# EAGLE schematic Arduino-Pro-Mini (EAGLE 8.0.1)
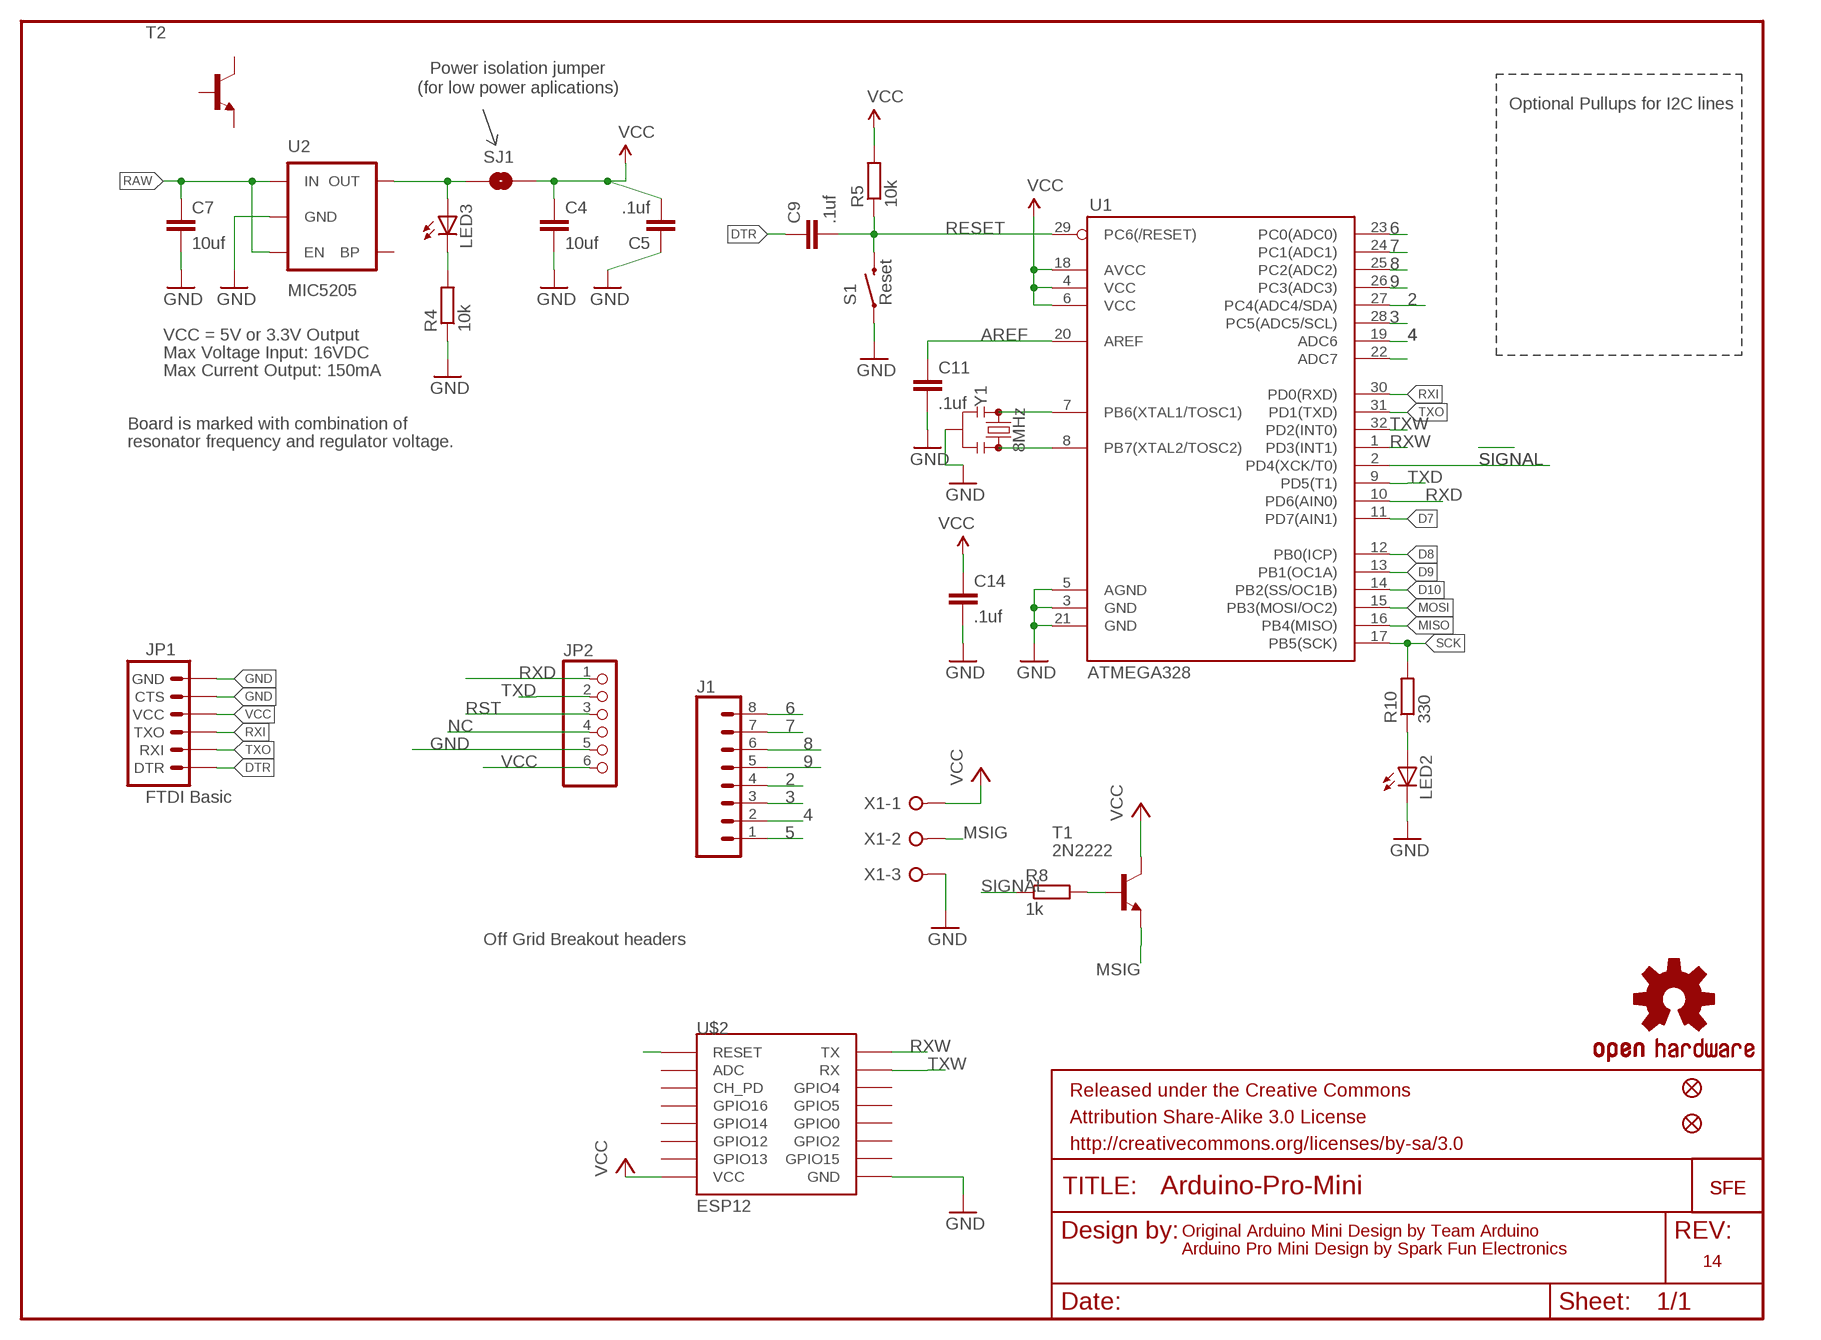
[diagram p0: schematic, sheet 1]

## Parts
C4  10uf  C-EUC1206  [C1206]
C5  .1uf  C-EUC1206  [C1206]
C7  10uf  C-EUC1206  [C1206]
C9  .1uf  C-EUC1206  [C1206]
C11  .1uf  C-EUC1206  [C1206]
C14  .1uf  C-EUC1206  [C1206]
FRAME1  FRAME-LETTER  [CREATIVE_COMMONS]
J1  CONN_08"  [1X08]
JP1  FTDI Basic  ARDUINO_SERIAL_PROGRAMPTH  [1X06]
JP2  PINHD-1X6  [1X06]
JP5  FIDUCIALUFIDUCIAL  [MICRO-FIDUCIAL]
JP8  FIDUCIALUFIDUCIAL  [MICRO-FIDUCIAL]
LED2  LEDCHIPLED_1206  [CHIPLED_1206]
LED3  LEDCHIPLED_1206  [CHIPLED_1206]
R4  10k  R-EU_M1206  [M1206]
R5  10k  R-EU_M1206  [M1206]
R8  1k  R-EU_M1206  [M1206]
R10  330  R-EU_M1206  [M1206]
S1  Reset  SWITCH-MOMENTARY-2SMD-ALT01  [TACTILE-SWITCH-SMD-ALT01]
SJ1  SOLDERJUMPERNC  [SJ_2S]
T1  2N2222  [TO92-EBC-OVAL]
T2  -NPN-SOT223  [SOT223]
U1  ATMEGA328  ATMEGA168  [TQFP32-08]
U2  MIC5205  V_REG_LDOSMD  [SOT23-5]
U$1  LOGO-SFESK  [SFE-LOGO-FLAME]
U$2  ESP12  [ESP12]
U$3  OSHW-LOGOS  [OSHW-LOGO-S]
U$11  LOGO-SFENEW  [SFE-NEW-WEBLOGO]
X1  W237-3E  [W237-3E]
Y1  8MHz  RESONATOR-8MHZSMD_3.2X1.3  [RESONATOR-SMD-3.2X1.3]

## Nets
2: J1.4 U1.27(PC4(ADC4/SDA))
3: J1.3 U1.28(PC5(ADC5/SCL))
4: J1.2 U1.19(ADC6)
5: J1.1 U1.22(ADC7)
6: J1.8 U1.23(PC0(ADC0))
7: J1.7 U1.24(PC1(ADC1))
8: J1.6 U1.25(PC2(ADC2))
9: J1.5 U1.26(PC3(ADC3))
AREF: C11.1 U1.20(AREF)
D7: U1.11(PD7(AIN1))
D8: U1.12(PB0(ICP))
D9: U1.13(PB1(OC1A))
D10: U1.14(PB2(SS/OC1B))
DTR: C9.1 JP1.1(DTR)
GND [vcc]: C4.2 C5.1 C7.2 C11.2 C14.2 JP1.5(CTS) JP1.6(GND) JP2.5 LED2.C R4.1 S1.1 S1.2 U1.3(GND) U1.5(AGND) U1.21(GND) U2.2(GND) U$2.GND X1.3 Y1.2
MISO: U1.16(PB4(MISO))
MOSI: U1.15(PB3(MOSI/OC2))
MSIG: X1.2
N$1: U1.8(PB7(XTAL2/TOSC2)) Y1.3
N$2: U1.7(PB6(XTAL1/TOSC1)) Y1.1
N$3: LED3.A SJ1.1 U2.5(OUT)
N$4: LED3.C R4.2
N$5: R8.1
N$6: R8.2 T1.B
N$7: LED2.A R10.1
N$8: T1.E
N$9: U$2.RESET
NC: JP2.4
RAW [vcc]: C7.1 U2.1(IN) U2.3(EN)
RESET: C9.2 R5.1 S1.3 S1.4 U1.29(PC6(/RESET))
RST: JP2.3
RXD: JP2.1 U1.10(PD6(AIN0))
RXI: JP1.3(TXO) U1.30(PD0(RXD))
RXW: U1.1(PD3(INT1)) U$2.TX
SCK: R10.2 U1.17(PB5(SCK))
SIGNAL: U1.2(PD4(XCK/T0))
TXD: JP2.2 U1.9(PD5(T1))
TXO: JP1.2(RXI) U1.31(PD1(TXD))
TXW: U1.32(PD2(INT0)) U$2.RX
VCC: C4.1 C5.2 C14.1 JP1.4(VCC) JP2.6 R5.2 SJ1.2 T1.C U1.4(VCC) U1.6(VCC) U1.18(AVCC) U$2.VCC X1.1
Unconnected: T2.1(B) T2.3(E) T2.4(C) U2.4(BP) U$2.ADC U$2.CH_PD U$2.GPIO0 U$2.GPIO2 U$2.GPIO4 U$2.GPIO5 U$2.GPIO12 U$2.GPIO13 U$2.GPIO14 U$2.GPIO15 U$2.GPIO16

## Notes on the sheet
- Power isolation jumper
- (for low power aplications)
- Optional Pullups for I2C lines
- VCC = 5V or 3.3V Output
- Max Voltage Input: 16VDC
- Max Current Output: 150mA
- Board is marked with combination of
- resonator frequency and regulator voltage.
- Off Grid Breakout headers
- Original Arduino Mini Design by Team Arduino
- Arduino Pro Mini Design by Spark Fun Electronics
- 14

## Library data of the parts
C4 C5 C7 C9 C11 C14 = rcl:C-EU: CAPACITOR, European symbol
FRAME1 = SparkFun-Aesthetics:FRAME-LETTER: Schematic Frame Standard 8.5x11 US Letter frame
J1 = SparkFun-Connectors:CONN_08: Multi connection point. Often used as Generic Header-pin footprint for 0.1 inch spaced/style header connections On any of the 0.1 inch spaced packages, you can populate with these: Break Away Headers - Straight <https://www.sparkfun.com/products/116> (PRT-00116) Break Away Male Headers - Right Angle <https://www.sparkfun.com/products/553> (PRT-00553) Female Headers <https://www.sparkfun.com/products/115> (PRT-00115) Break Away Headers - Machine Pin <https://www.sparkfun.com/products/117> (PRT-00117) Break Away Female Headers - Swiss Machine Pin <https://www.sparkfun.com/products/743> (PRT-00743) Arduino Stackable Header - 8 Pin <https://www.sparkfun.com/products/9279> (PRT-09279) For SCREWTERMINALS and SPRING TERMINALS visit here: Screw Terimnals on SparkFun.com <https://www.sparkfun.com/search/results?term=Screw+Terminals> (5mm/3.5mm/2.54mm spacing) This device is also useful as a general connection point to wire up your design to another part of your project. Our various solder wires solder well into these plated through hole pads. Hook-Up Wire - Assortment (Stranded, 22 AWG) <https://www.sparkfun.com/products/11375> (PRT-11375) Hook-Up Wire - Assortment (Solid Core, 22 AWG) <https://www.sparkfun.com/products/11367> (PRT-11367) View the entire wire category on our website here <https://www.sparkfun.com/categories/141> Special notes: Molex polarized connector foot print use with SKU : PRT-08231 with associated crimp pins and housings. 1MM SMD Version SKU: PRT-10208 NOTES ON THE VARIANTS LOCK and LOCK_LONGPADS... This footprint was designed to help hold the alignment of a through-hole component (i.e. 6-pin header) while soldering it into place. You may notice that each hole has been shifted either up or down by 0.005 of an inch from it's more standard position (which is a perfectly straight line). This slight alteration caused the pins (the squares in the middle) to touch the edges of the holes. Because they are alternating, it causes a "brace" to hold the component in place. 0.005 has proven to be the perfect amount of "off-center" position when using our standard breakaway headers. Although looks a little odd when you look at the bare footprint, once you have a header in there, the alteration is very hard to notice. Also,if you push a header all the way into place, it is covered up entirely on the bottom side.; PROD_ID: CONN-08438
JP1 = SparkFun:ARDUINO_SERIAL_PROGRAM
JP2 = adafruit:PINHD-1X6: PIN HEADER
JP5 JP8 = SparkFun:FIDUCIAL: Fiducial Alignment Points Various fiducial points for machine vision alignment.
LED2 LED3 = adafruit:LED: LED OSRAM: - CHIPLED LG R971, LG N971, LY N971, LG Q971, LY Q971, LO R971, LY R971 LH N974, LH R974 LS Q976, LO Q976, LY Q976 LO Q996 - Hyper CHIPLED LW Q18S LB Q993, LB Q99A, LB R99A - SideLED LS A670, LO A670, LY A670, LG A670, LP A670 LB A673, LV A673, LT A673, LW A673 LH A674 LY A675 LS A676, LA A676, LO A676, LY A676, LW A676 LS A679, LY A679, LG A679 - Hyper Micro SIDELED® LS Y876, LA Y876, LO Y876, LY Y876 LT Y87S - SmartLED LW L88C, LW L88S LB L89C, LB L89S, LG L890 LS L89K, LO L89K, LY L89K LS L896, LA L896, LO L896, LY L896 - TOPLED LS T670, LO T670, LY T670, LG T670, LP T670 LSG T670, LSP T670, LSY T670, LOP T670, LYG T670 LG T671, LOG T671, LSG T671 LB T673, LV T673, LT T673, LW T673 LH T674 LS T676, LA T676, LO T676, LY T676, LB T676, LH T676, LSB T676, LW T676 LB T67C, LV T67C, LT T67C, LS T67K, LO T67K, LY T67K, LW E67C LS E67B, LA E67B, LO E67B, LY E67B, LB E67C, LV E67C, LT E67C LW T67C LS T679, LY T679, LG T679 LS T770, LO T770, LY T770, LG T770, LP T770 LB T773, LV T773, LT T773, LW T773 LH T774 LS E675, LA E675, LY E675, LS T675 LS T776, LA T776, LO T776, LY T776, LB T776 LHGB T686 LT T68C, LB T68C - Hyper Mini TOPLED® LB M676 - Mini TOPLED Santana® LG M470 LS M47K, LO M47K, LY M47K Source: http://www.osram.convergy.de/
R4 R5 R8 R10 = rcl:R-EU_: RESISTOR, European symbol
S1 = Testing:SWITCH-MOMENTARY-2: Various NO switches- pushbuttons, reed, etc
SJ1 = SparkFun-Passives:SOLDERJUMPER: Solder Jumper Standard SMD solder jumper. Used to automate production. Two varients : Normally Open and Normally Closed are the same, but have different paste layers. NC will have a large amount of paste and should jumper during reflow.
T1 = adafruit:2N2222: NPN TRANSISTOR Big oval pads
T2 = transistor-neu-to92:*-NPN-: NPN Transistror
U1 = SparkFun:ATMEGA168
U2 = SparkFun:V_REG_LDO: Voltage Regulator LDO Standard 150mA LDO voltage regulator in SOT-23 layout. Micrel part MIC5205. BP (by-pass) pin is used to lower output noise with 470pF cap.
U$1 U$11 = SparkFun:LOGO-SFE: Spark Fun Electronics PCB Logo This is the standard Spark Fun Electronics PCB logo.
U$2 = esp8266modules:ESP12: ESP8266 Wifi module 12
U$3 = SparkFun:OSHW-LOGO: Open Source Hardware Logo This logo indicates the piece of hardware it is found on incorporates a OSHW license and/or adheres to the definition of open source hardware found here: http://freedomdefined.org/OSHW
X1 = con-wago-508:W237-3E: WAGO SREW CLAMP; OC_FARNELL: unknown; OC_NEWARK: unknown
Y1 = SparkFun-Clocks:RESONATOR-8MHZ: 8MHz Resonator Digikey Example <http://www.digikey.com/product-detail/en/murata-electronics-north-america/CSTCE10M0G55-R0/490-1196-1-ND/584633> Frequency: 8MHz Frequency Stability: ±0.2% Frequency Tolerance: ±0.5% Capacitance: 33pF SparkFun Products Arduino Pro Mini 328- 3.3V/8MHz <https://www.sparkfun.com/products/11114> SparkFun Digital Sandbox <https://www.sparkfun.com/products/12651>; PROD_ID: XTAL-08895

## Net classes
0 default: width 0.203 mm
1 vcc: width 0.254 mm